# EAGLE board udisk (EAGLE 4.11), part 1 of 2
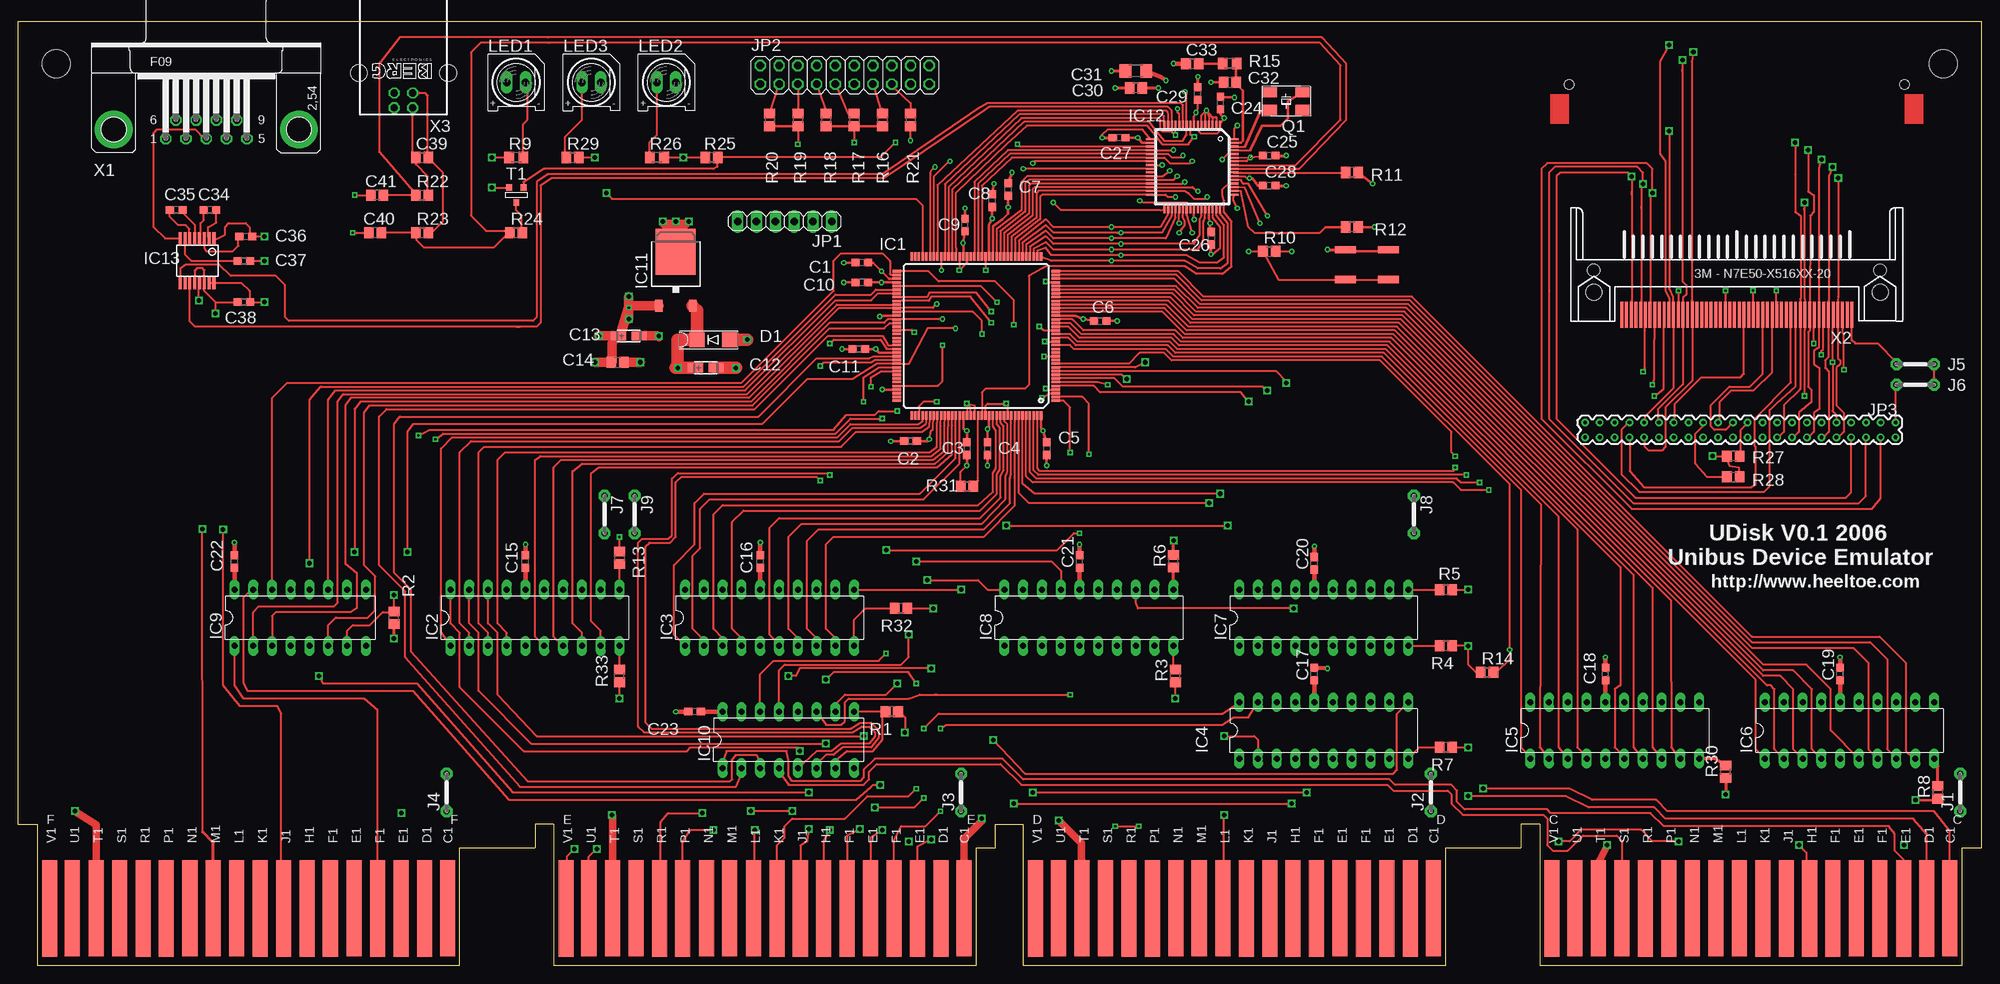
[diagram p7: board, top side]
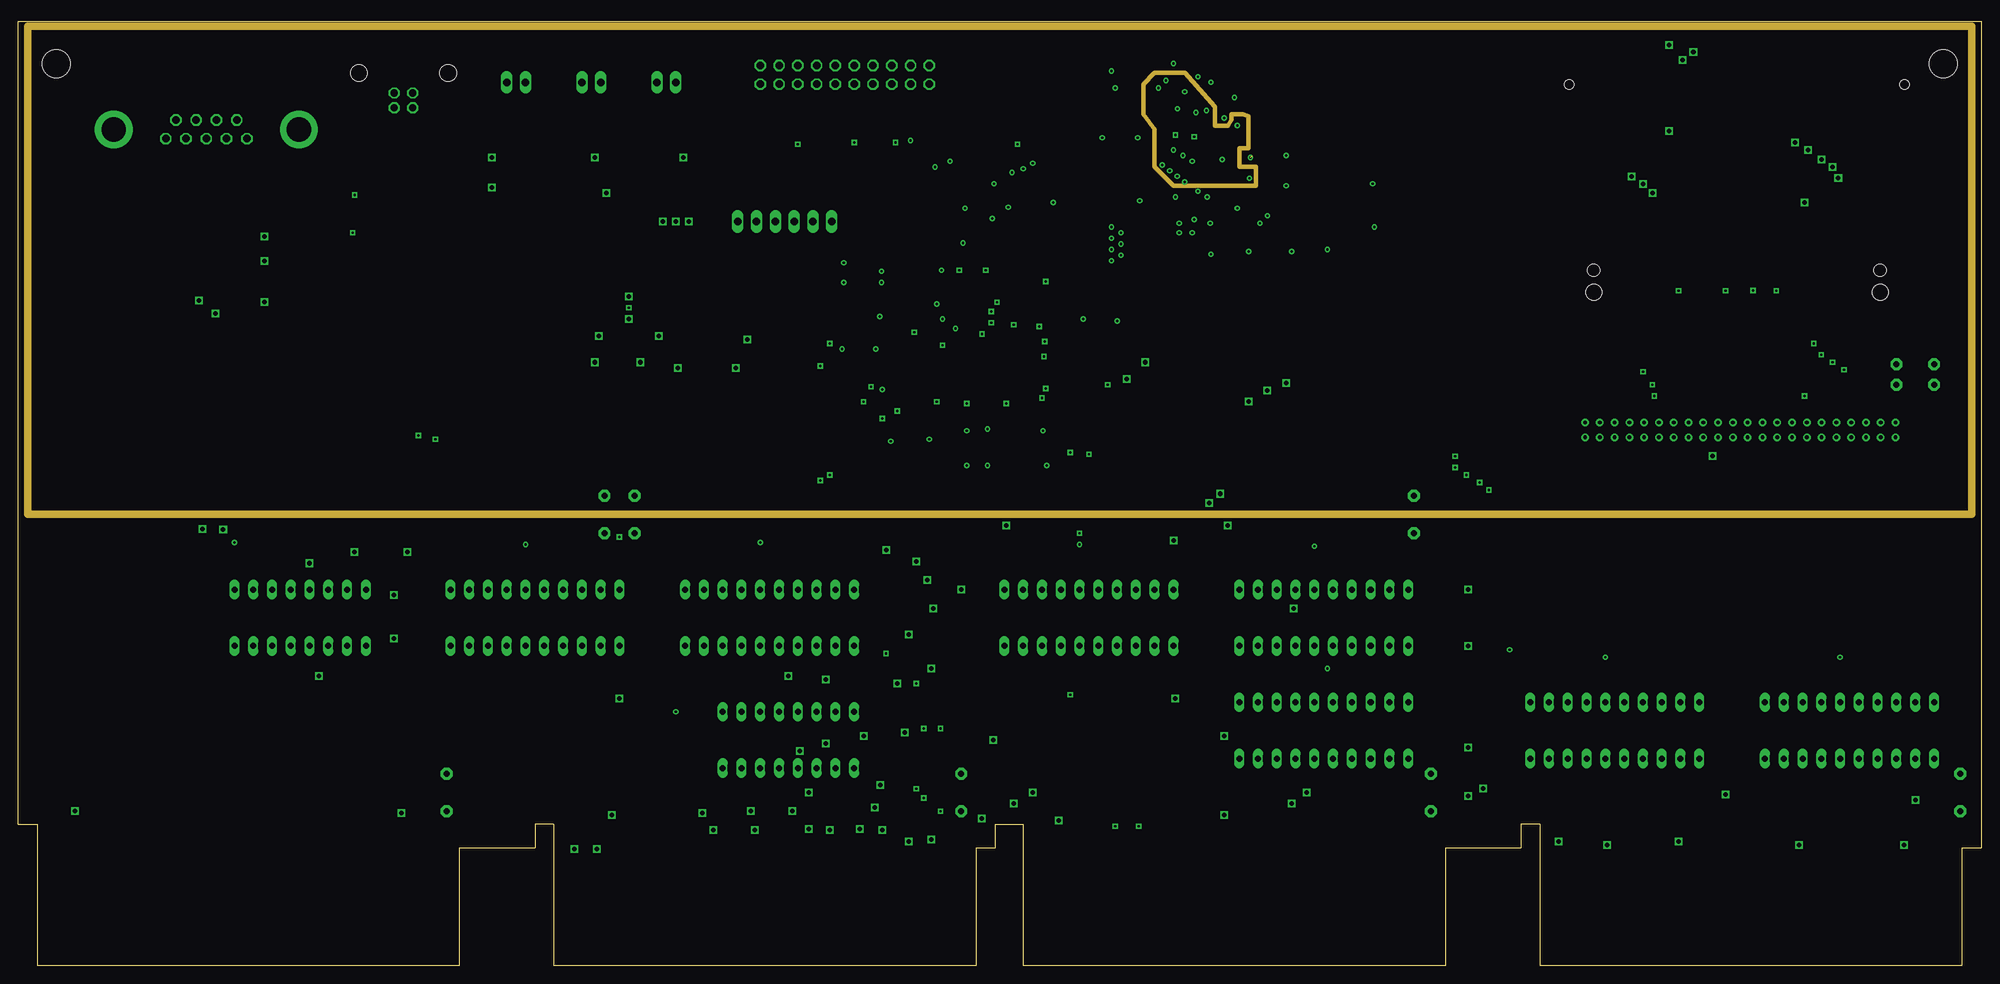
[diagram p8: board, inner layer $+5V]
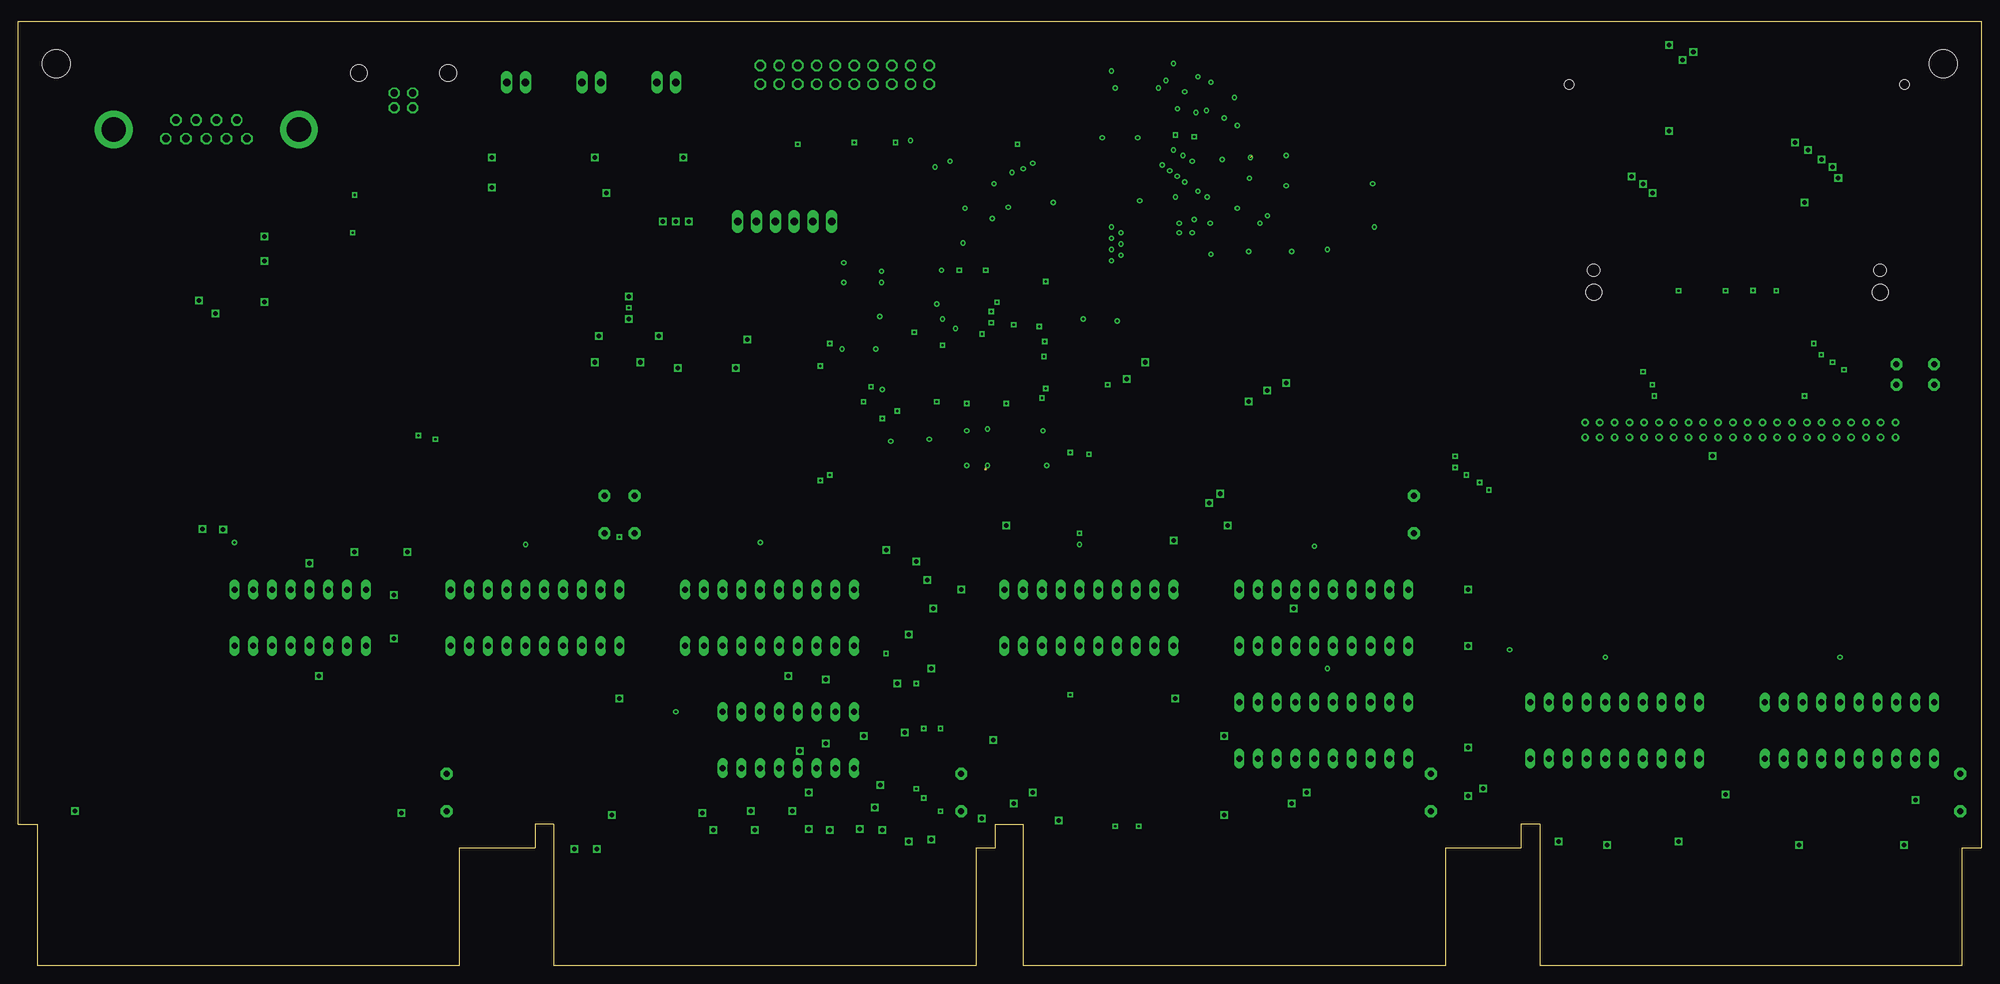
[diagram p9: board, inner layer $GND]
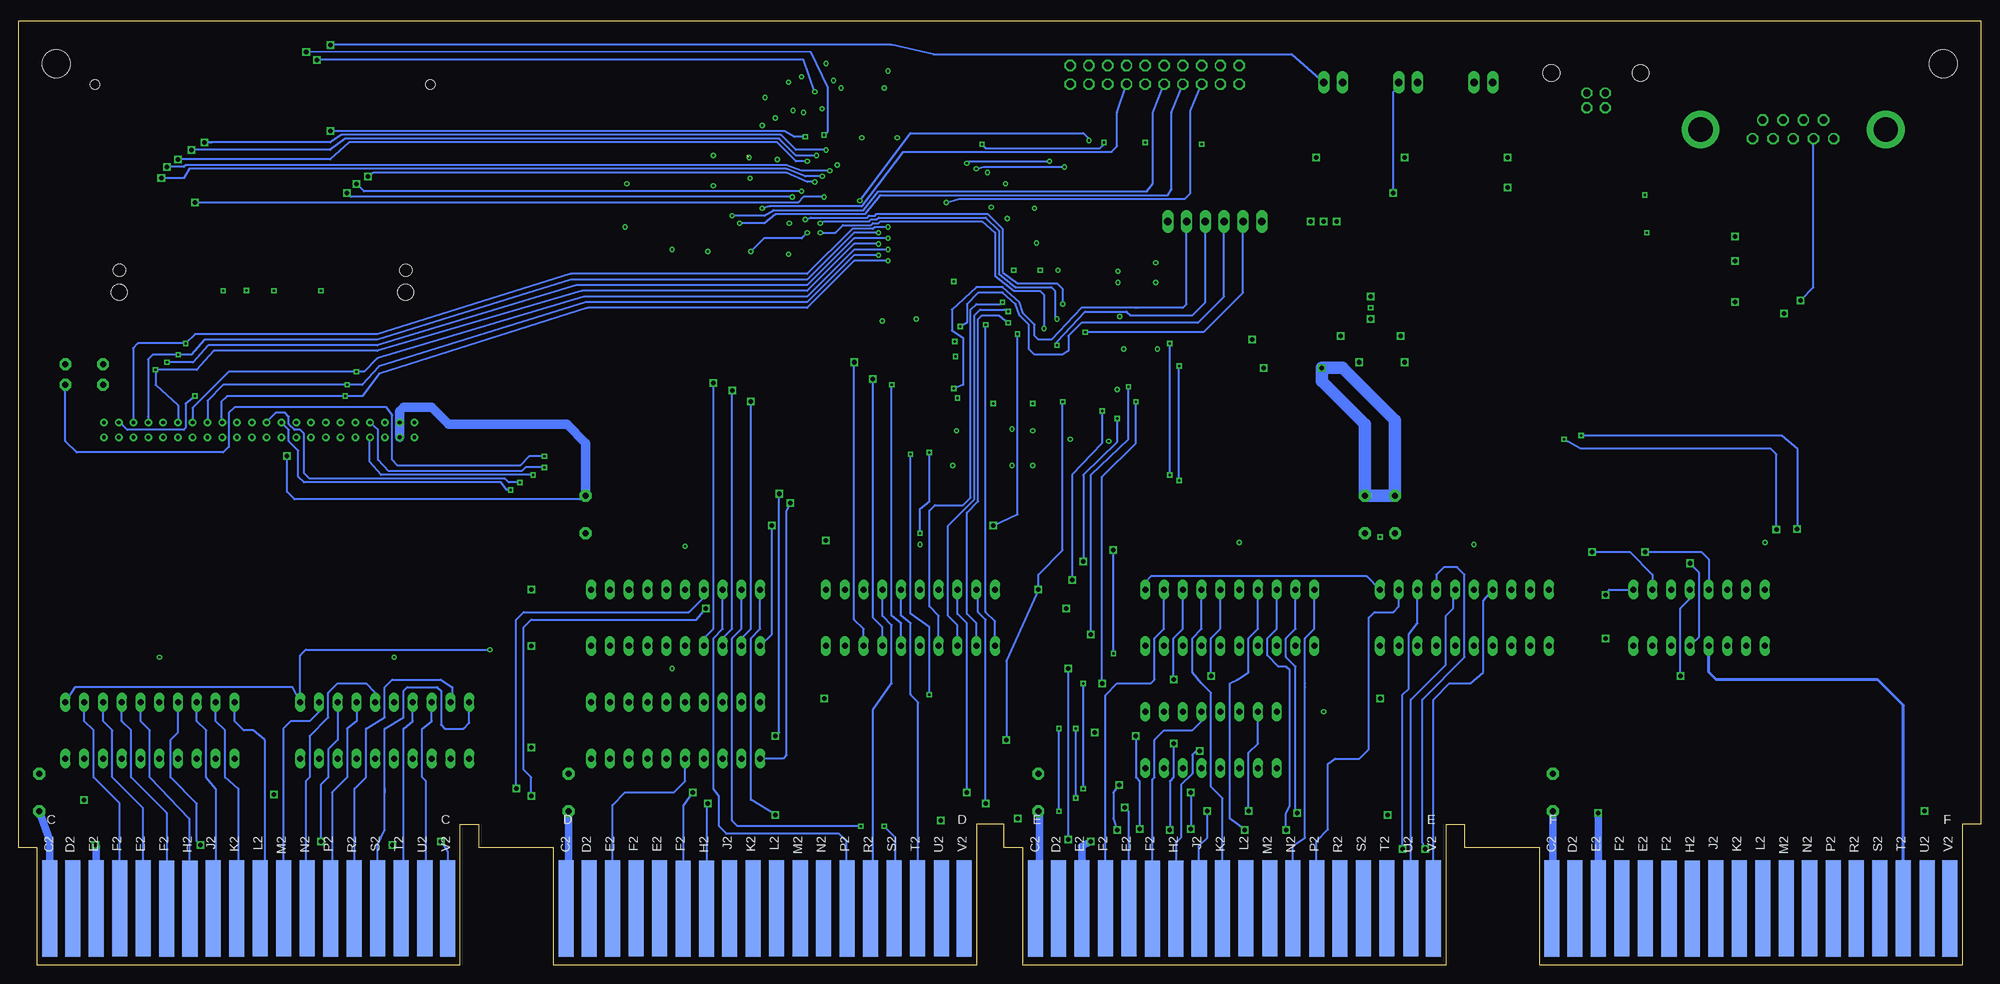
[diagram p10: board, bottom side, seen from below]

Size 265.43 x 127.64 mm. Coordinates in mm from the lower left corner, seen from the top.
Outline: 69.85,15.88 59.69,15.88 59.69,0 2.54,0 2.54,19.05 0,19.05 0,127.64 265.43,127.64 265.43,15.88 262.89,15.88 262.89,0 205.74,0 205.74,19.05 203.2,19.05 203.2,15.88 193.04,15.88 193.04,0 135.89,0 135.89,19.05 132.13,19.05 132.13,15.88 129.54,15.88 129.54,0 72.39,0 72.39,19.05 69.9,19.05 69.9,15.88
Copper layers (1+2*3*4+15+16): Top 0.0356mm / dielectric 0.2007mm / $+5V 0.0356mm / dielectric 0mm / $+3V3 0.0356mm / dielectric 0mm / $vddcore 0.0356mm / dielectric 0.2007mm / $GND 0.0356mm / dielectric 0.2007mm / Bottom 0.0356mm
Design rules "default": minimum track width 10mil, minimum drill 10mil, track to track 7mil, track to pad 6mil, pad to pad 5mil, via to via 7mil, smd to smd 5mil, copper to edge 25mil, drill to drill 8mil, minimum pad ring 10mil, minimum via ring 8mil, stop-mask expansion 4mil, vias tented up to drill 0mil, thermal gap 10mil
Holes 3.81 mm at 5.08,121.92 260.35,121.92

## Footprints (pad centres in the part's own frame; a part is rotated, then mirrored left to right if it is on the bottom)
C0603 = smd 1.1 x 1: 1 -0.85,0; 2 0.85,0
CT3216 = smd 2 x 1.2: + 1.4,0; - -1.4,0
C0805 = smd 1.3 x 1.5: 1 -0.85,0; 2 0.85,0
C1206 = smd 1.6 x 1.8: 1 -1.4,0; 2 1.4,0
SMA = smd 2 x 2: 1 -2.2,0; 2 2.2,0
TQ144 = smd 1.2 x 0.35: 1 -10.75,8.75; 2 -10.75,8.25; 3 -10.75,7.75; 4 -10.75,7.25; 5 -10.75,6.75; 6 -10.75,6.25; 7 -10.75,5.75; 8 -10.75,5.25; 9 -10.75,4.75; 10 -10.75,4.25; 11 -10.75,3.75; 12 -10.75,3.25; 13 -10.75,2.75; 14 -10.75,2.25; 15 -10.75,1.75; 16 -10.75,1.25; 17 -10.75,0.75; 18 -10.75,0.25; 19 -10.75,-0.25; 20 -10.75,-0.75; 21 -10.75,-1.25; 22 -10.75,-1.75; 23 -10.75,-2.25; 24 -10.75,-2.75; 25 -10.75,-3.25; 26 -10.75,-3.75; 27 -10.75,-4.25; 28 -10.75,-4.75; 29 -10.75,-5.25; 30 -10.75,-5.75; 31 -10.75,-6.25; 32 -10.75,-6.75; 33 -10.75,-7.25; 34 -10.75,-7.75; 35 -10.75,-8.25; 36 -10.75,-8.75; 73 10.75,-8.75; 74 10.75,-8.25; 75 10.75,-7.75; 76 10.75,-7.25; 77 10.75,-6.75; 78 10.75,-6.25; 79 10.75,-5.75; 80 10.75,-5.25; 81 10.75,-4.75; 82 10.75,-4.25; 83 10.75,-3.75; 84 10.75,-3.25; 85 10.75,-2.75; 86 10.75,-2.25; 87 10.75,-1.75; 88 10.75,-1.25; 89 10.75,-0.75; 90 10.75,-0.25; 91 10.75,0.25; 92 10.75,0.75; 93 10.75,1.25; 94 10.75,1.75; 95 10.75,2.25; 96 10.75,2.75; 97 10.75,3.25; 98 10.75,3.75; 99 10.75,4.25; 100 10.75,4.75; 101 10.75,5.25; 102 10.75,5.75; 103 10.75,6.25; 104 10.75,6.75; 105 10.75,7.25; 106 10.75,7.75; 107 10.75,8.25; 108 10.75,8.75 | smd 0.35 x 1.2: 37 -8.75,-10.75; 38 -8.25,-10.75; 39 -7.75,-10.75; 40 -7.25,-10.75; 41 -6.75,-10.75; 42 -6.25,-10.75; 43 -5.75,-10.75; 44 -5.25,-10.75; 45 -4.75,-10.75; 46 -4.25,-10.75; 47 -3.75,-10.75; 48 -3.25,-10.75; 49 -2.75,-10.75; 50 -2.25,-10.75; 51 -1.75,-10.75; 52 -1.25,-10.75; 53 -0.75,-10.75; 54 -0.25,-10.75; 55 0.25,-10.75; 56 0.75,-10.75; 57 1.25,-10.75; 58 1.75,-10.75; 59 2.25,-10.75; 60 2.75,-10.75; 61 3.25,-10.75; 62 3.75,-10.75; 63 4.25,-10.75; 64 4.75,-10.75; 65 5.25,-10.75; 66 5.75,-10.75; 67 6.25,-10.75; 68 6.75,-10.75; 69 7.25,-10.75; 70 7.75,-10.75; 71 8.25,-10.75; 72 8.75,-10.75; 109 8.75,10.75; 110 8.25,10.75; 111 7.75,10.75; 112 7.25,10.75; 113 6.75,10.75; 114 6.25,10.75; 115 5.75,10.75; 116 5.25,10.75; 117 4.75,10.75; 118 4.25,10.75; 119 3.75,10.75; 120 3.25,10.75; 121 2.75,10.75; 122 2.25,10.75; 123 1.75,10.75; 124 1.25,10.75; 125 0.75,10.75; 126 0.25,10.75; 127 -0.25,10.75; 128 -0.75,10.75; 129 -1.25,10.75; 130 -1.75,10.75; 131 -2.25,10.75; 132 -2.75,10.75; 133 -3.25,10.75; 134 -3.75,10.75; 135 -4.25,10.75; 136 -4.75,10.75; 137 -5.25,10.75; 138 -5.75,10.75; 139 -6.25,10.75; 140 -6.75,10.75; 141 -7.25,10.75; 142 -7.75,10.75; 143 -8.25,10.75; 144 -8.75,10.75
DIL20 = drill 0.813 long: 1 -11.43,-3.81; 2 -8.89,-3.81; 3 -6.35,-3.81; 4 -3.81,-3.81; 5 -1.27,-3.81; 6 1.27,-3.81; 7 3.81,-3.81; 8 6.35,-3.81; 9 8.89,-3.81; 10 11.43,-3.81; 11 11.43,3.81; 12 8.89,3.81; 13 6.35,3.81; 14 3.81,3.81; 15 1.27,3.81; 16 -1.27,3.81; 17 -3.81,3.81; 18 -6.35,3.81; 19 -8.89,3.81; 20 -11.43,3.81
DIL16 = drill 0.813 long: 1 -8.89,-3.81; 2 -6.35,-3.81; 3 -3.81,-3.81; 4 -1.27,-3.81; 5 1.27,-3.81; 6 3.81,-3.81; 7 6.35,-3.81; 8 8.89,-3.81; 9 8.89,3.81; 10 6.35,3.81; 11 3.81,3.81; 12 1.27,3.81; 13 -1.27,3.81; 14 -3.81,3.81; 15 -6.35,3.81; 16 -8.89,3.81
TO252 = smd 1 x 1.6: 1 -2.28,-4.8; 2 2.28,-4.8 | smd 5.4 x 6.2: 3 0,2.5
LQFP64 = smd 1.1 x 0.285: 1 -5.7,3.75; 2 -5.7,3.25; 3 -5.7,2.75; 4 -5.7,2.25; 5 -5.7,1.75; 6 -5.7,1.25; 7 -5.7,0.75; 8 -5.7,0.25; 9 -5.7,-0.25; 10 -5.7,-0.75; 11 -5.7,-1.25; 12 -5.7,-1.75; 13 -5.7,-2.25; 14 -5.7,-2.75; 15 -5.7,-3.25; 16 -5.7,-3.75; 33 5.7,-3.75; 34 5.7,-3.25; 35 5.7,-2.75; 36 5.7,-2.25; 37 5.7,-1.75; 38 5.7,-1.25; 39 5.7,-0.75; 40 5.7,-0.25; 41 5.7,0.25; 42 5.7,0.75; 43 5.7,1.25; 44 5.7,1.75; 45 5.7,2.25; 46 5.7,2.75; 47 5.7,3.25; 48 5.7,3.75 | smd 0.285 x 1.1: 17 -3.75,-5.7; 18 -3.25,-5.7; 19 -2.75,-5.7; 20 -2.25,-5.7; 21 -1.75,-5.7; 22 -1.25,-5.7; 23 -0.75,-5.7; 24 -0.25,-5.7; 25 0.25,-5.7; 26 0.75,-5.7; 27 1.25,-5.7; 28 1.75,-5.7; 29 2.25,-5.7; 30 2.75,-5.7; 31 3.25,-5.7; 32 3.75,-5.7; 49 3.75,5.7; 50 3.25,5.7; 51 2.75,5.7; 52 2.25,5.7; 53 1.75,5.7; 54 1.25,5.7; 55 0.75,5.7; 56 0.25,5.7; 57 -0.25,5.7; 58 -0.75,5.7; 59 -1.25,5.7; 60 -1.75,5.7; 61 -2.25,5.7; 62 -2.75,5.7; 63 -3.25,5.7; 64 -3.75,5.7
TSSOP-16 = smd 0.42 x 1.78: 1 -2.3,-2.975; 2 -1.65,-2.975; 3 -1,-2.975; 4 -0.35,-2.975; 5 0.3,-2.975; 6 0.95,-2.975; 7 1.6,-2.975; 8 2.25,-2.975; 9 2.25,2.975; 10 1.6,2.975; 11 0.95,2.975; 12 0.3,2.975; 13 -0.35,2.975; 14 -1,2.975; 15 -1.65,2.975; 16 -2.3,2.975
05 = drill 0.813 pad 1.6 octagon: 1 -2.54,0; 2 2.54,0
1X06 = drill 1.016 long: 1 -6.35,0; 2 -3.81,0; 3 -1.27,0; 4 1.27,0; 5 3.81,0; 6 6.35,0
2X10 = drill 1.016 octagon: 1 -11.43,-1.27; 2 -11.43,1.27; 3 -8.89,-1.27; 4 -8.89,1.27; 5 -6.35,-1.27; 6 -6.35,1.27; 7 -3.81,-1.27; 8 -3.81,1.27; 9 -1.27,-1.27; 10 -1.27,1.27; 11 1.27,-1.27; 12 1.27,1.27; 13 3.81,-1.27; 14 3.81,1.27; 15 6.35,-1.27; 16 6.35,1.27; 17 8.89,-1.27; 18 8.89,1.27; 19 11.43,-1.27; 20 11.43,1.27
2X22 = drill 0.508 round: 1 -24,-1; 2 -24,1; 3 -22,-1; 4 -22,1; 5 -20,-1; 6 -20,1; 7 -18,-1; 8 -18,1; 9 -16,-1; 10 -16,1; 11 -14,-1; 12 -14,1; 13 -12,-1; 14 -12,1; 15 -10,-1; 16 -10,1; 17 -8,-1; 18 -8,1; 19 -6,-1; 20 -6,1; 21 -4,-1; 22 -4,1; 23 -2,-1; 24 -2,1; 25 0,-1; 26 0,1; 27 2,-1; 28 2,1; 29 4,-1; 30 4,1; 31 6,-1; 32 6,1; 33 8,-1; 34 8,1; 35 10,-1; 36 10,1; 37 12,-1; 38 12,1; 39 14,-1; 40 14,1; 41 16,-1; 42 16,1; 43 18,-1; 44 18,1
Q62902-B156 = drill 1.016 long: A -1.27,0; K 1.27,0
SM406 = smd 1.9 x 1.4: 1 -2.2,-1.2; 2 2.2,-1.2; 3 2.2,1.2; 4 -2.2,1.2
R0805 = smd 1.3 x 1.5: 1 -0.85,0; 2 0.85,0
M0805 = smd 1.3 x 1.6: 1 -0.95,0; 2 0.95,0
KSC241J = smd 2.8 x 1: P1 -2.9,2; P2 2.9,2; P3 -2.9,-2; P4 2.9,-2
SOT-23 = smd 0.787 x 0.889: 1 0.025,-1.016; 2 -0.94,1.016; 3 0.991,1.016
EDGE-CON8 = smd 2.032 x 13.017: CA1 261.223,7.709; CB1 258.118,7.684; CC1 254.956,7.684; CD1 251.765,7.684; CE1 248.59,7.693; CF1 245.389,7.668; CH1 242.24,7.668; CJ1 239.09,7.668; CK1 235.915,7.668; CL1 232.74,7.693; CM1 229.54,7.693; CN1 226.39,7.693; CP1 223.19,7.668; CR1 220.04,7.668; CS1 216.865,7.693; CT1 213.69,7.693; CU1 210.49,7.693; CV1 207.404,7.668; DA1 191.373,7.709; DB1 188.268,7.684; DC1 185.106,7.684; DD1 181.915,7.684; DE1 178.74,7.693; DF1 175.539,7.668; DH1 172.39,7.668; DJ1 169.24,7.668; DK1 166.065,7.668; DL1 162.89,7.693; DM1 159.69,7.693; DN1 156.54,7.693; DP1 153.34,7.668; DR1 150.19,7.668; DS1 147.015,7.693; DT1 143.84,7.693; DU1 140.64,7.693; DV1 137.554,7.668; EA1 127.873,7.709; EB1 124.768,7.684; EC1 121.606,7.684; ED1 118.415,7.684; EE1 115.24,7.693; EF1 112.039,7.668; EH1 108.89,7.668; EJ1 105.74,7.668; EK1 102.565,7.668; EL1 99.39,7.693; EM1 96.19,7.693; EN1 93.04,7.693; EP1 89.84,7.668; ER1 86.69,7.668; ES1 83.515,7.693; ET1 80.34,7.693; EU1 77.14,7.693; EV1 74.054,7.668; FA1 58.023,7.709; FB1 54.918,7.684; FC1 51.756,7.684; FD1 48.565,7.684; FE1 45.39,7.693; FF1 42.189,7.668; FH1 39.04,7.668; FJ1 35.89,7.668; FK1 32.715,7.668; FL1 29.54,7.693; FM1 26.34,7.693; FN1 23.19,7.693; FP1 19.99,7.668; FR1 16.84,7.668; FS1 13.665,7.693; FT1 10.49,7.693; FU1 7.29,7.693; FV1 4.204,7.668 | smd 2.032 x 13.017 bottom: CA2 261.223,7.69; CB2 258.102,7.668; CC2 254.94,7.668; CD2 251.765,7.693; CE2 248.59,7.693; CF2 245.389,7.642; CH2 242.24,7.642; CJ2 239.09,7.668; CK2 235.915,7.668; CL2 232.74,7.693; CM2 229.54,7.693; CN2 226.39,7.693; CP2 223.19,7.668; CR2 220.04,7.668; CS2 216.865,7.693; CT2 213.69,7.693; CU2 210.464,7.693; CV2 207.404,7.668; DA2 191.373,7.69; DB2 188.252,7.668; DC2 185.09,7.668; DD2 181.915,7.693; DE2 178.74,7.693; DF2 175.539,7.642; DH2 172.39,7.642; DJ2 169.24,7.668; DK2 166.065,7.668; DL2 162.89,7.693; DM2 159.69,7.693; DN2 156.54,7.693; DP2 153.34,7.668; DR2 150.19,7.668; DS2 147.015,7.693; DT2 143.84,7.693; DU2 140.614,7.693; DV2 137.554,7.668; EA2 127.873,7.69; EB2 124.752,7.668; EC2 121.59,7.668; ED2 118.415,7.693; EE2 115.24,7.693; EF2 112.039,7.642; EH2 108.89,7.642; EJ2 105.74,7.668; EK2 102.565,7.668; EL2 99.39,7.693; EM2 96.19,7.693; EN2 93.04,7.693; EP2 89.84,7.668; ER2 86.69,7.668; ES2 83.515,7.693; ET2 80.34,7.693; EU2 77.114,7.693; EV2 74.054,7.668; FA2 58.023,7.69; FB2 54.902,7.668; FC2 51.74,7.668; FD2 48.565,7.693; FE2 45.39,7.693; FF2 42.189,7.642; FH2 39.04,7.642; FJ2 35.89,7.668; FK2 32.715,7.668; FL2 29.54,7.693; FM2 26.34,7.693; FN2 23.19,7.693; FP2 19.99,7.668; FR2 16.84,7.668; FS2 13.665,7.693; FT2 10.49,7.693; FU2 7.264,7.693; FV2 4.204,7.668
F09HP = drill 1.016 octagon: 1 -5.486,-1.27; 2 -2.743,-1.27; 3 0,-1.27; 4 2.743,-1.27; 5 5.486,-1.27; 6 -4.115,1.27; 7 -1.372,1.27; 8 1.372,1.27; 9 4.115,1.27 | drill 3.302 pad 5.08 round: G1 -12.522,0; G2 12.522,0
N7E50516 = smd 0.4 x 3.5: 1 -15.557,6.015; 2 -14.287,6.015; 3 -13.018,6.015; 4 -11.748,6.015; 5 -10.477,6.015; 6 -9.207,6.015; 7 -7.938,6.015; 8 -6.668,6.015; 9 -5.397,6.015; 10 -4.128,6.015; 11 -2.857,6.015; 12 -1.587,6.015; 13 -0.318,6.015; 14 0.953,6.015; 15 2.223,6.015; 16 3.493,6.015; 17 4.763,6.015; 18 6.032,6.015; 19 7.303,6.015; 20 8.572,6.015; 21 9.842,6.015; 22 11.113,6.015; 23 12.383,6.015; 24 13.652,6.015; 25 14.922,6.015; 26 -14.922,6.015; 27 -13.652,6.015; 28 -12.383,6.015; 29 -11.113,6.015; 30 -9.842,6.015; 31 -8.572,6.015; 32 -7.303,6.015; 33 -6.032,6.015; 34 -4.763,6.015; 35 -3.493,6.015; 36 -2.223,6.015; 37 -0.953,6.015; 38 0.318,6.015; 39 1.587,6.015; 40 2.857,6.015; 41 4.128,6.015; 42 5.397,6.015; 43 6.668,6.015; 44 7.938,6.015; 45 9.207,6.015; 46 10.477,6.015; 47 11.748,6.015; 48 13.018,6.015; 49 14.287,6.015; 50 15.557,6.015 | hole 1.7: -19.37,0; 19.37,0 | hole 2.2: -19.37,3; 19.37,3 | hole 1.3: 22.7,-25.1; -22.7,-25.1
PN61729 = drill 0.95 octagon: 1 1.25,4.71; 2 -1.25,4.71; 3 -1.25,2.71; 4 1.25,2.71 | hole 2.3: -6.02,0; 6.02,0

## Placement (x,y rotation side)
C1  0.1uf  [C0603]  114.05,95 180 top
C2  0.1uf  [C0603]  120.65,70.87 180 top
C3  0.1uf  [C0603]  128.27,69.85 270 top
C4  0.1uf  [C0603]  131.06,69.85 270 top
C5  0.1uf  [C0603]  139.06,69.85 270 top
C6  0.1uf  [C0603]  146.3,87.12 0 top
C7  0.1uf  [C0603]  133.86,104.9 90 top
C8  0.1uf  [C0603]  131.7,103.38 90 top
C9  0.1uf  [C0603]  128.02,100.08 90 top
C10  0.1uf  [C0603]  114.05,92.33 180 top
C11  0.1uf  [C0603]  113.67,83.31 180 top
C12  10uf  [CT3216]  92.96,80.77 180 top
C13  4.7uf  [CT3216]  82.55,85.09 180 top
C14  0.01uf  [C0805]  81.03,81.53 0 top
C15  0.1uf  [C0603]  68.58,54.61 90 top
C16  0.1uf  [C0603]  100.33,54.61 90 top
C17  0.1uf  [C0603]  175.26,39.37 90 top
C18  0.1uf  [C0603]  214.63,39.37 90 top
C19  0.1uf  [C0603]  246.38,39.37 90 top
C20  0.1uf  [C0603]  175.26,54.36 90 top
C21  0.1uf  [C0603]  143.51,54.61 90 top
C22  0.1uf  [C0603]  29.21,54.61 90 top
C23  0.1uf  [C0603]  91.44,34.29 180 top
C24  0.1uf  [C0603]  162.56,116.59 90 top
C25  0.1uf  [C0603]  169.16,109.47 0 top
C26  0.1uf  [C0603]  161.29,98.3 270 top
C27  0.1uf  [C0603]  148.84,111.89 180 top
C28  0.1uf  [C0603]  169.16,105.41 0 top
C29  0.1uf  [C0603]  159.51,117.86 90 top
C30  1000pf  [C0805]  151.13,118.62 180 top
C31  2.2uf  [C1206]  151.13,120.9 180 top
C32  100pf  [C0805]  163.83,119.38 0 top
C33  0.01uf  [C0805]  158.75,121.92 0 top
C34  0.1uf  [C0603]  25.91,102.11 180 top
C35  0.1uf  [C0603]  21.34,102.11 180 top
C36  0.1uf  [C0603]  30.73,98.55 0 top
C37  0.1uf  [C0603]  30.48,95.25 0 top
C38  0.1uf  [C0603]  30.48,89.66 180 top
C39  33pf  [C0805]  54.61,109.22 0 top
C40  15pf  [C0805]  48.26,99.06 180 top
C41  15pf  [C0805]  48.51,104.14 180 top
D1  TVS 7.5V  [SMA]  93.98,84.58 0 top
IC1  [TQ144]  129.54,85.09 180 top
IC2  DS3862N  [DIL20]  69.85,46.99 0 top
IC3  DS3862N  [DIL20]  101.6,46.99 0 top
IC4  DS3862N  [DIL20]  176.53,31.75 0 top
IC5  DS3862N  [DIL20]  215.9,31.75 0 top
IC6  DS3862N  [DIL20]  247.65,31.75 0 top
IC7  DS3862N  [DIL20]  176.53,46.99 0 top
IC8  DS3862N  [DIL20]  144.78,46.99 0 top
IC9  DS8641N  [DIL16]  38.1,46.99 0 top
IC10  DS8641N  [DIL16]  104.14,30.48 0 top
IC11  LP8345  [TO252]  88.9,93.98 0 top
IC12  [LQFP64]  158.75,107.95 270 top
IC13  MAX3221CPWRG  [TSSOP-16]  24.13,95.25 180 top
J1  J5MM  [05]  262.64,23.37 90 top
J2  J5MM  [05]  191.01,23.37 90 top
J3  J5MM  [05]  127.51,23.37 90 top
J4  J5MM  [05]  57.91,23.37 90 top
J5  J5MM  [05]  256.54,81.28 180 top
J6  J5MM  [05]  256.54,78.49 180 top
J7  J5MM  [05]  79.25,60.96 270 top
J8  J5MM  [05]  188.72,60.96 270 top
J9  J5MM  [05]  83.31,60.96 270 top
JP1  [1X06]  103.63,100.58 180 top
JP2  [2X10]  111.76,120.4 0 top
JP3  [2X22]  229.87,72.39 180 top
LED1  GREEN  [Q62902-B156]  67.31,119.38 0 top
LED2  yellow  [Q62902-B156]  87.63,119.38 0 top
LED3  [Q62902-B156]  77.47,119.38 0 top
Q1  18.432Mhz  [SM406]  171.45,116.84 180 top
R1  0 ohm  [R0805]  118.11,34.29 180 top
R2  0 ohm  [R0805]  50.8,46.99 90 top
R3  0 ohm  [R0805]  156.46,39.12 90 top
R4  0 ohm  [R0805]  193.04,43.18 180 top
R5  0 ohm  [R0805]  193.04,50.8 0 top
R6  0 ohm  [R0805]  156.21,54.61 90 top
R7  1k  [R0805]  193.04,29.46 180 top
R8  1k  [R0805]  259.59,23.37 90 top
R9  75  [M0805]  67.31,109.22 0 top
R10  10k  [R0805]  169.16,96.52 0 top
R11  0 ohm  [R0805]  180.34,107.19 180 top
R12  0 ohm  [R0805]  180.34,99.82 180 top
R13  10k  [R0805]  81.28,55.12 270 top
R14  10k  [R0805]  198.63,39.62 0 top
R15  499  [M0805]  163.83,121.92 0 top
R16  47.5k  [R0805]  116.84,114.3 270 top
R17  47.5k  [R0805]  113.03,114.3 270 top
R18  47.5k  [R0805]  109.22,114.3 270 top
R19  47.5k  [R0805]  105.41,114.3 270 top
R20  47.5k  [R0805]  101.6,114.3 270 top
R21  0 ohm  [R0805]  120.65,114.3 270 top
R22  27  [R0805]  54.61,104.14 0 top
R23  27  [R0805]  54.61,99.06 0 top
R24  1.5k  [R0805]  67.31,99.06 0 top
R25  100k  [R0805]  93.73,109.22 180 top
R26  1k  [M0805]  86.36,109.22 0 top
R27  10k  [R0805]  231.9,66.04 0 top
R28  10k  [R0805]  231.9,68.83 180 top
R29  140  [R0805]  74.93,109.22 0 top
R30  1k  [R0805]  230.89,26.16 90 top
R31  0 ohm  [R0805]  128.27,64.77 0 top
R32  1k  [R0805]  119.38,48.26 180 top
R33  1k  [R0805]  81.28,39.12 90 top
S1  [KSC241J]  182.37,94.74 0 top
T1  [SOT-23]  67.31,104.14 0 top
U$1  [EDGE-CON8]  0,0 0 top
X1  [F09HP]  25.4,113.03 0 top
X2  [N7E50516]  232.41,93.98 180 top
X3  [PN61729]  52.07,120.65 180 top